# EAGLE design BlinkyBoard (EAGLE 9.6.1)
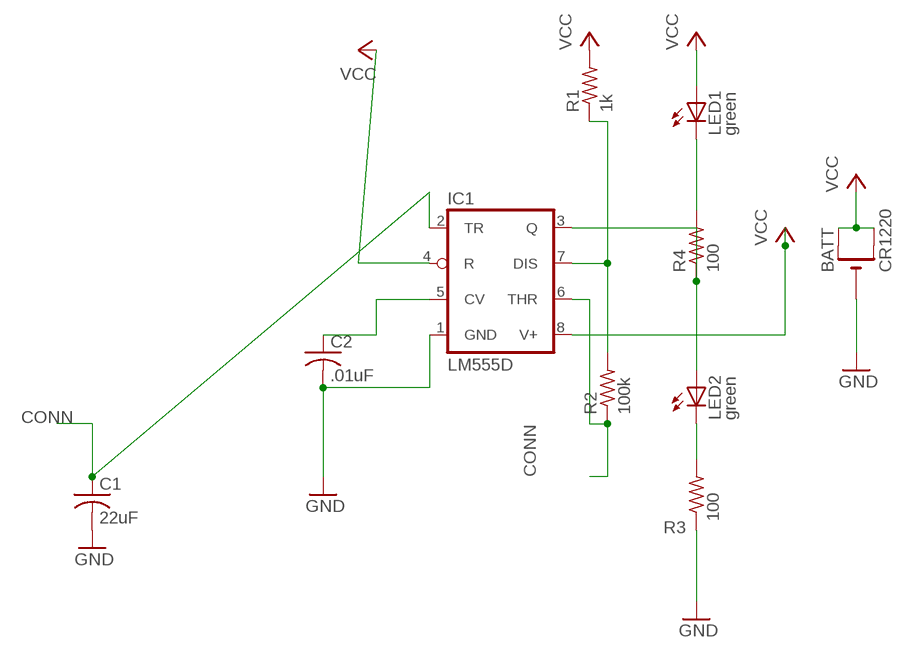
[diagram p0: schematic, sheet 1]

## Parts
BATT  CR1220  CR1220SMT  [CR1220-SMD]
C1  22uF  C-USC0805  [C0805]
C2  .01uF  C-USC0805  [C0805]
IC1  LM555D  [SO08]
LED1  green  LEDCHIPLED_0805  [CHIPLED_0805]
LED2  green  LEDCHIPLED_0805  [CHIPLED_0805]
R1  1k  R-US_R0805  [R0805]
R2  100k  R-US_R0805  [R0805]
R3  100  R-US_R0805  [R0805]
R4  100  R-US_R0805  [R0805]

## Nets
CONN: C1.1 IC1.2(TR) IC1.6(THR) R2.1
GND: BATT.- C1.2 C2.2 IC1.1(GND) R3.1
N$1: LED1.C R4.2
N$2: IC1.3(Q) LED2.A R4.1
N$3: LED2.C R3.2
N$4: IC1.7(DIS) R1.1 R2.2
N$7: C2.1 IC1.5(CV)
VCC: BATT.+$1(+) BATT.+$2(+1) IC1.4(R) IC1.8(V+) LED1.A R1.2

## Library data of the parts
BATT = adafruit:CR1220: CR1216/CR1220/CR1225 12mm 3V lithium coin cell Great for battery packup. Both SMT and THM holders. Note the THM package has the ground pads on both sides of the PCB so that the masks are the same - this reduces the cost; OC_NEWARK: unknown
C1 = adafruit:C-US: CAPACITOR, American symbol; MF: KEMET; MPN: CDR31BX103AKZS; OC_NEWARK: 33AH0843
C2 = adafruit:C-US: CAPACITOR, American symbol; MF: VISHAY; MPN: MKT1813422635G; OC_NEWARK: 04M4381
IC1 = adafruit:*555: TIMER Changed DIP package to have round (not oval) pin pads http://www.ladyada.net/library/pcb/eaglelibrary.html; MF: TEXAS INSTRUMENTS; MPN: TLC555CP; OC_NEWARK: 28AH5371
LED1 LED2 = adafruit:LED: LED OSRAM: - CHIPLED LG R971, LG N971, LY N971, LG Q971, LY Q971, LO R971, LY R971 LH N974, LH R974 LS Q976, LO Q976, LY Q976 LO Q996 - Hyper CHIPLED LW Q18S LB Q993, LB Q99A, LB R99A - SideLED LS A670, LO A670, LY A670, LG A670, LP A670 LB A673, LV A673, LT A673, LW A673 LH A674 LY A675 LS A676, LA A676, LO A676, LY A676, LW A676 LS A679, LY A679, LG A679 - Hyper Micro SIDELED® LS Y876, LA Y876, LO Y876, LY Y876 LT Y87S - SmartLED LW L88C, LW L88S LB L89C, LB L89S, LG L890 LS L89K, LO L89K, LY L89K LS L896, LA L896, LO L896, LY L896 - TOPLED LS T670, LO T670, LY T670, LG T670, LP T670 LSG T670, LSP T670, LSY T670, LOP T670, LYG T670 LG T671, LOG T671, LSG T671 LB T673, LV T673, LT T673, LW T673 LH T674 LS T676, LA T676, LO T676, LY T676, LB T676, LH T676, LSB T676, LW T676 LB T67C, LV T67C, LT T67C, LS T67K, LO T67K, LY T67K, LW E67C LS E67B, LA E67B, LO E67B, LY E67B, LB E67C, LV E67C, LT E67C LW T67C LS T679, LY T679, LG T679 LS T770, LO T770, LY T770, LG T770, LP T770 LB T773, LV T773, LT T773, LW T773 LH T774 LS E675, LA E675, LY E675, LS T675 LS T776, LA T776, LO T776, LY T776, LB T776 LHGB T686 LT T68C, LB T68C - Hyper Mini TOPLED® LB M676 - Mini TOPLED Santana® LG M470 LS M47K, LO M47K, LY M47K Source: http://www.osram.convergy.de/; MF: LUMEX; MPN: SML-LX0805GC-TR; OC_NEWARK: 09J9136
R1 = adafruit:R-US_: RESISTOR, American symbol; MF: HONEYWELL; MPN: 700-102AAB-B00; OC_NEWARK: 50M8329
R2 = adafruit:R-US_: RESISTOR, American symbol; MF: VISHAY; MPN: CRCW0805100RJNEA; OC_NEWARK: 01H7765
R3 R4 = adafruit:R-US_: RESISTOR, American symbol; MF: NEOHM - TE CONNECTIVITY; MPN: 1614883-1; OC_NEWARK: 01AH0196

## Board
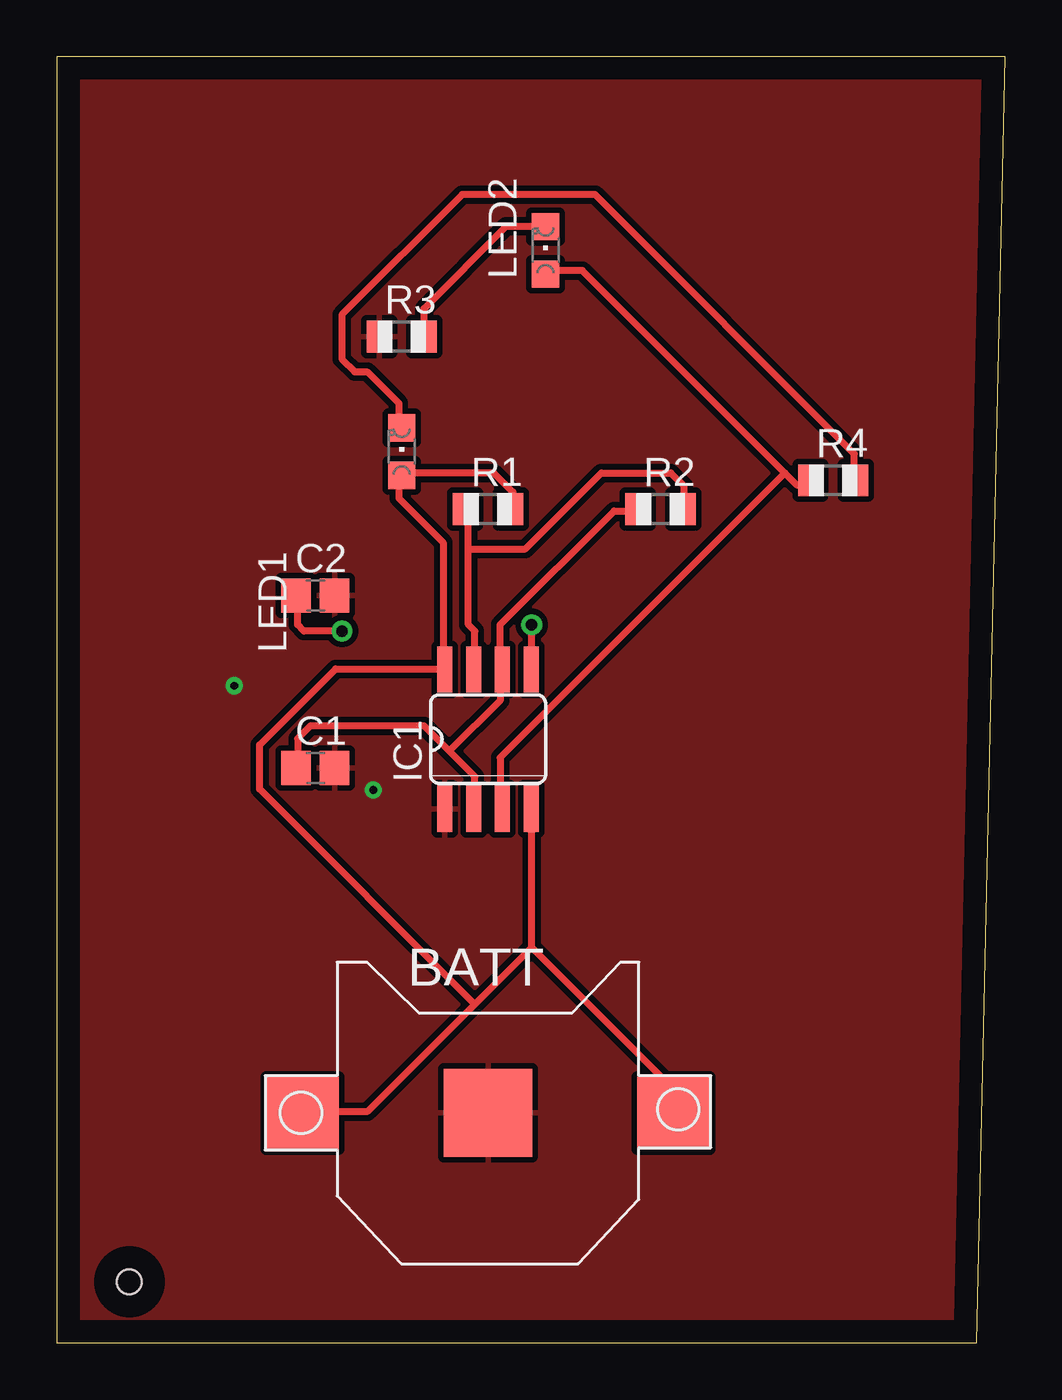
[diagram p1: board, top side]
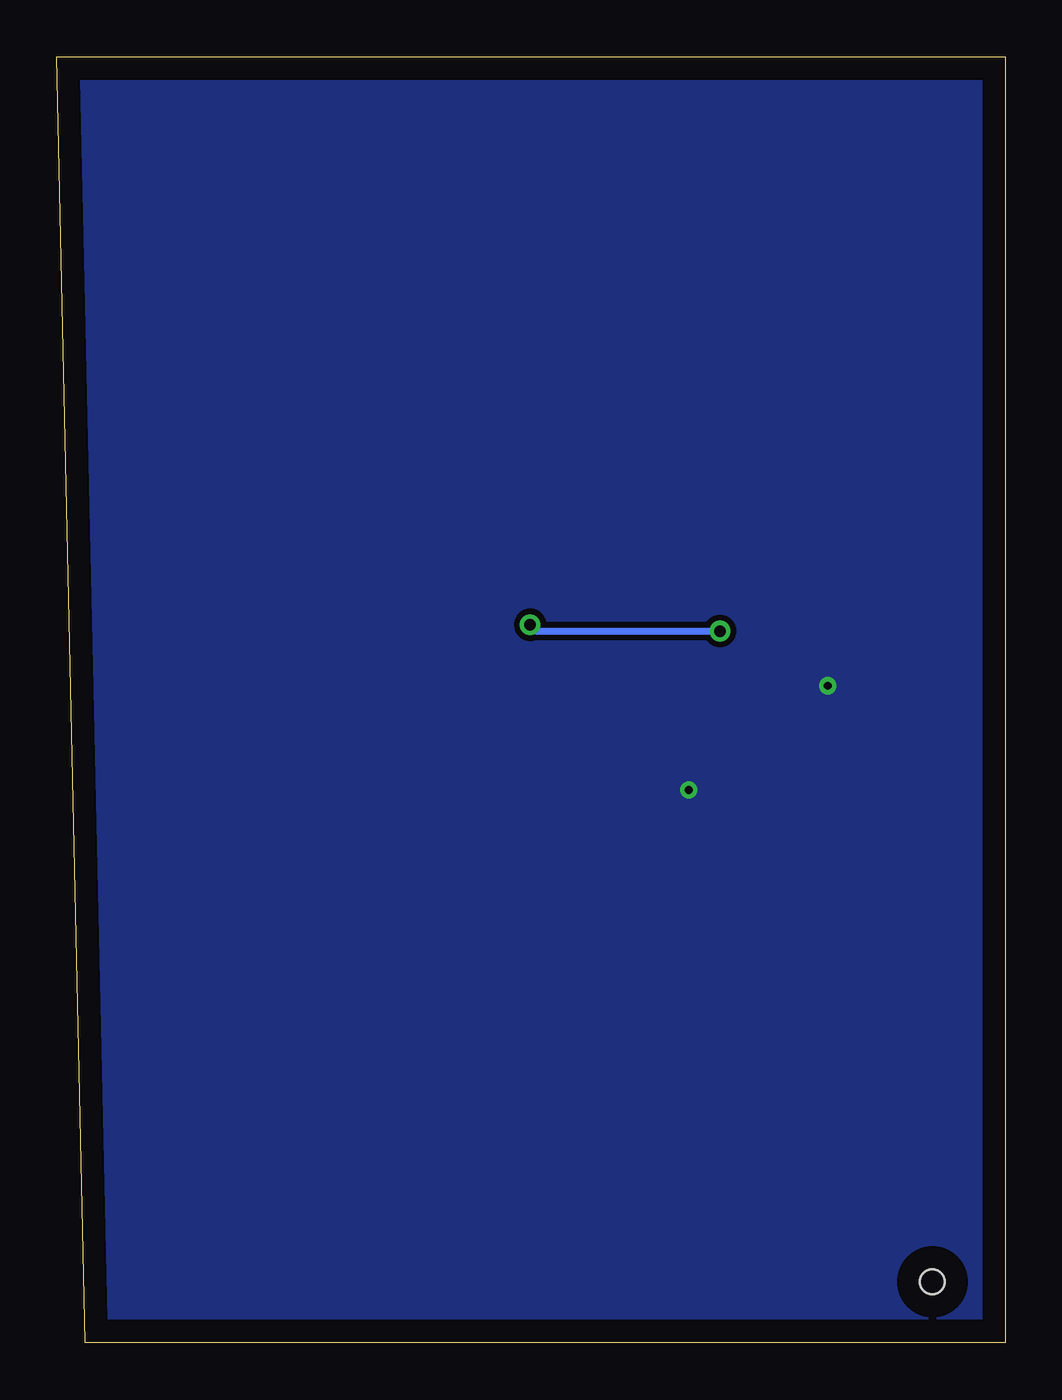
[diagram p2: board, bottom side, seen from below]

Size 41.89 x 56.82 mm. Coordinates in mm from the lower left corner, seen from the top.
Outline: 0,0 40.62,0 41.89,56.82 0,56.82 0,0
Copper layers (1*16): Top 0.035mm / dielectric 1.5mm / Bottom 0.035mm
Design rules "default *": minimum track width 6mil, minimum drill 20mm, track to track 6mil, track to pad 6mil, pad to pad 6mil, via to via 6mil, smd to smd 6mil, copper to edge 40mil, drill to drill 6mil, minimum pad ring 10mil, minimum via ring 8mil, stop-mask expansion 4mil, vias tented up to drill 0mil, thermal gap 10mil
Holes 1.09 mm at 3.22,2.7

### Footprints (pad centres in the part's own frame; a part is rotated, then mirrored left to right if it is on the bottom)
CR1220-SMD = smd 3.2 x 3.2: +$1 -8.2,0; +$2 8.2,0 | smd 3.9 x 3.9: - 0,0
C0805 = smd 1.3 x 1.5: 1 -0.85,0; 2 0.85,0
SO08 = smd 0.66 x 2.032: 1 -1.905,-3.073; 2 -0.635,-3.073; 3 0.635,-3.073; 4 1.905,-3.073; 5 1.905,3.073; 6 0.635,3.073; 7 -0.635,3.073; 8 -1.905,3.073
CHIPLED_0805 = smd 1.2 x 1.2: A 0,-1.05; C 0,1.05
R0805 = smd 1.1 x 1.4: 1 -1,0; 2 1,0

### Placement (x,y rotation side)
BATT  19.05,10.16 0 top
C1  11.43,25.4 0 top
C2  11.43,33.02 0 top
IC1  19.05,26.67 0 top
LED1  15.24,39.37 0 top
LED2  21.59,48.26 0 top
R1  19.05,36.83 0 top
R2  26.67,36.83 0 top
R3  15.24,44.45 0 top
R4  34.29,38.1 0 top

### Tracks (layer width: path | path; a pad name or v marks a point on that pad's centre or on a via)
CONN
  Top 0.305: 17.35,26.14 18.47,25.02 18.47,23.62 IC1.2 | 17.35,26.14 16.23,27.25 11.2,27.25 10.64,26.7 10.64,25.58 C1.1 | R2.1 25.45,36.75 24.61,36.75 19.58,31.72 19.58,29.77 IC1.6 19.58,29.49 19.58,28.37 17.35,26.14
GND  (via drill 0.35)
  other vias: 7.85,29.03 13.98,24.43
  pour Top: -8.89,60.96 -8.89,2.54 6.35,-12.7 39.37,-12.7 52.07,0 52.07,50.8 41.91,60.96
  pour Bottom: -12.96,64.27 -12.96,0.96 6.05,-18.05 39.01,-18.05 56.84,-0.22 56.84,52.98 44.07,65.75 -11.48,65.75
N$1
  Top 0.305: LED1.C 15.11,40.67 15.11,41.5 13.72,42.9 13.16,42.9 12.6,43.46 12.6,45.42 17.91,50.72 23.77,50.72 35.23,39.27 35.23,38.15 R4.2
N$2
  Top 0.305: 32.16,38.43 32.72,37.87 33.27,37.87 R4.1 | 32.16,38.43 23.22,47.37 21.82,47.37 LED2.A | 32.16,38.43 19.58,25.86 19.58,23.62 IC1.3
N$3
  Top 0.305: LED2.C 21.54,49.33 19.86,49.33 16.23,45.7 16.23,44.58 R3.2
N$4
  Top 0.305: 18.19,35.08 18.19,31.72 18.47,31.45 18.47,29.77 IC1.7 | 18.19,35.08 18.19,36.75 R1.1 | 18.19,35.08 20.7,35.08 24.05,38.43 27.13,38.43 27.69,37.87 27.69,37.03 R2.2
N$7  (via drill 0.51)
  Top 0.305: v20.98,31.72 20.98,29.77 IC1.5 | C2.1 10.64,32.84 10.64,31.72 10.92,31.45 v12.6,31.45
  Bottom 0.305: v12.6,31.45 20.7,31.45 v20.98,31.72
VCC
  Top 0.305: R1.2 20.14,37.03 20.14,37.59 19.3,38.43 15.39,38.43 LED1.A 15.11,38.15 15.11,37.31 17.07,35.36 17.07,29.77 | 20.98,17.47 20.98,23.34 IC1.4 | 20.98,17.47 27.13,11.33 27.13,10.21 BATT.+$2 | 20.98,17.47 18.47,14.96 | 18.47,14.96 13.72,10.21 10.92,10.21 BATT.+$1 | 17.07,29.77 12.32,29.77 8.97,26.42 8.97,24.46 18.47,14.96 | 17.07,29.77 IC1.8